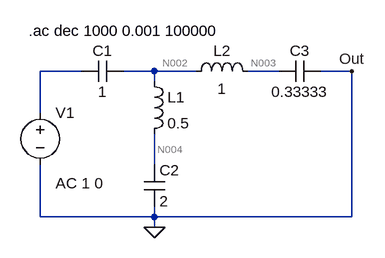
[diagram p0: schematic EJ1.asc]
EJ1.asc, the LTspice schematic file:
Version 4
SHEET 1 880 680
WIRE 48 112 -16 112
WIRE 160 112 112 112
WIRE 224 112 160 112
WIRE 352 112 304 112
WIRE 464 112 416 112
WIRE 160 128 160 112
WIRE -16 176 -16 112
WIRE 160 256 160 208
WIRE -16 336 -16 256
WIRE 160 336 160 320
WIRE 160 336 -16 336
WIRE 464 336 464 112
WIRE 464 336 160 336
WIRE 160 352 160 336
FLAG 160 352 0
FLAG 464 112 Out
SYMBOL cap 112 96 R90
WINDOW 0 0 32 VBottom 2
WINDOW 3 32 32 VTop 2
SYMATTR InstName C1
SYMATTR Value 1
SYMBOL ind 144 112 R0
SYMATTR InstName L1
SYMATTR Value 0.5
SYMBOL cap 144 256 R0
SYMATTR InstName C2
SYMATTR Value 2
SYMBOL ind 208 128 R270
WINDOW 0 32 56 VTop 2
WINDOW 3 5 56 VBottom 2
SYMATTR InstName L2
SYMATTR Value 1
SYMBOL cap 416 96 R90
WINDOW 0 0 32 VBottom 2
WINDOW 3 32 32 VTop 2
SYMATTR InstName C3
SYMATTR Value 0.33333
SYMBOL voltage -16 160 R0
WINDOW 123 24 124 Left 2
WINDOW 39 0 0 Left 0
SYMATTR InstName V1
SYMATTR Value ""
SYMATTR Value2 AC 1 0
TEXT -34 50 Left 2 !.ac dec 1000 0.001 100000

The netlist it stands for:
* EJ1.asc
C1 N002 N001 1
L1 N002 N004 0.5
C2 N004 0 2
L2 N002 N003 1
C3 0 N003 0.33333
V1 N001 0 AC 1 0
.ac dec 1000 0.001 100000
.backanno
.end

* Results of the author's LTspice run, read from the files saved beside the schematic
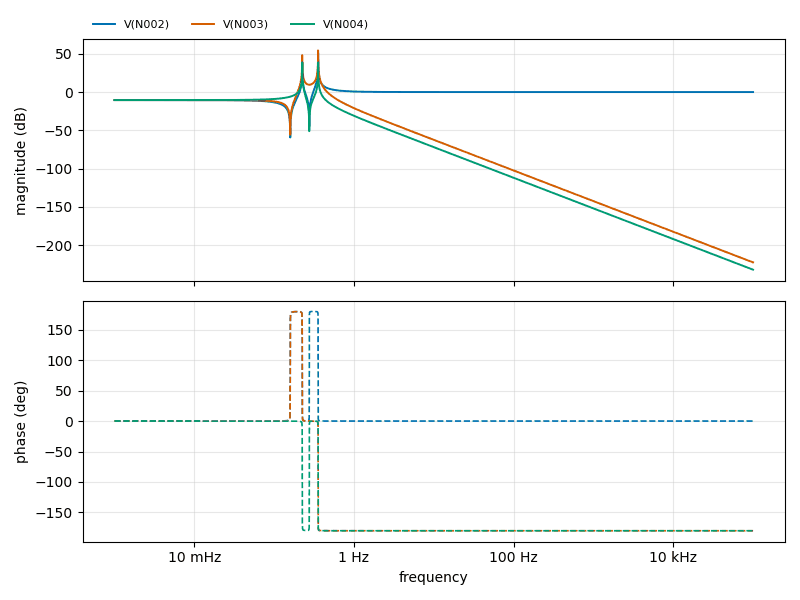
[diagram p1: AC Analysis of EJ1.asc, plotted from the saved traces]
* AC Analysis, 1 run:
*   V(N002): -10.46 dB at 1 mHz, 0.00 dB at 100 kHz, peak 50.83 dB at 355.6 mHz, 3 dB below the peak at 355.4 mHz and 356 mHz
*   V(N003): -10.46 dB at 1 mHz, -222.38 dB at 100 kHz, peak 54.38 dB at 355.6 mHz, 3 dB below the peak at 355.4 mHz and 356 mHz
*   V(N004): -10.46 dB at 1 mHz, -231.93 dB at 100 kHz, peak 38.80 dB at 355.6 mHz, 3 dB below the peak at 355.4 mHz and 356 mHz